# Altium schematic sheet 0603WAF1002T5E.schdoc
size 127 x 101 mm
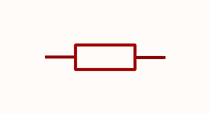
[diagram p0: 0603WAF1002T5E.schdoc]

## Parts
R?  0603waf1002t5e  [R0603]  (value not drawn)

## Nets

Not connected (* = marked no-connect by the designer): R? 1 2

## Library data of the parts
R? = 0603waf1002t5e: 电阻类型:厚膜电阻;阻值:10kΩ;精度:±1%;功率:100mW;工作电压:75V;温度系数:±100ppm/℃;; Manufacturer: UNI-ROYAL(厚声); AddInBom: yes; ModelId: fc143cca1e79419f9cd78b61e9279f08; ModelTransform: 31.8897,63.7794,0,90,0,0,0,0,0; Value: 10kΩ; Tolerance: ±1%; Power(Watts): 100mW; Voltage-Supply(Max): 75V; Symbol: 0603WAF1002T5E; LCSC Part Name: 厚膜电阻 10kΩ ±1% 100mW; SupplierPart: C25804; ManufacturerPart: 0603WAF1002T5E; Supplier Footprint: 0603; JLCPCB Part Class: Basic Part; Datasheet: https://item.szlcsc.com/datasheet/0603WAF1002T5E/26547.html; Supplier: LCSC; ConvertToPcb: yes; FootprintName: R0603; ModelName: R0603; Type: 厚膜电阻; Temperature Coefficient: ±100ppm/℃; Operating Temperature: -55℃~+155℃